# EasyEDA Pro project 国赛模拟试题文件.eprj

# Schematic 原理图文件
Create Date: 2023-05-26; Page Name: P1; Project Name: 考生demo; Schematic Name: 原理图文件; Update Date: 2023-05-26; Company: 嘉立创EDA; Page Size: A4; Version: V1.0
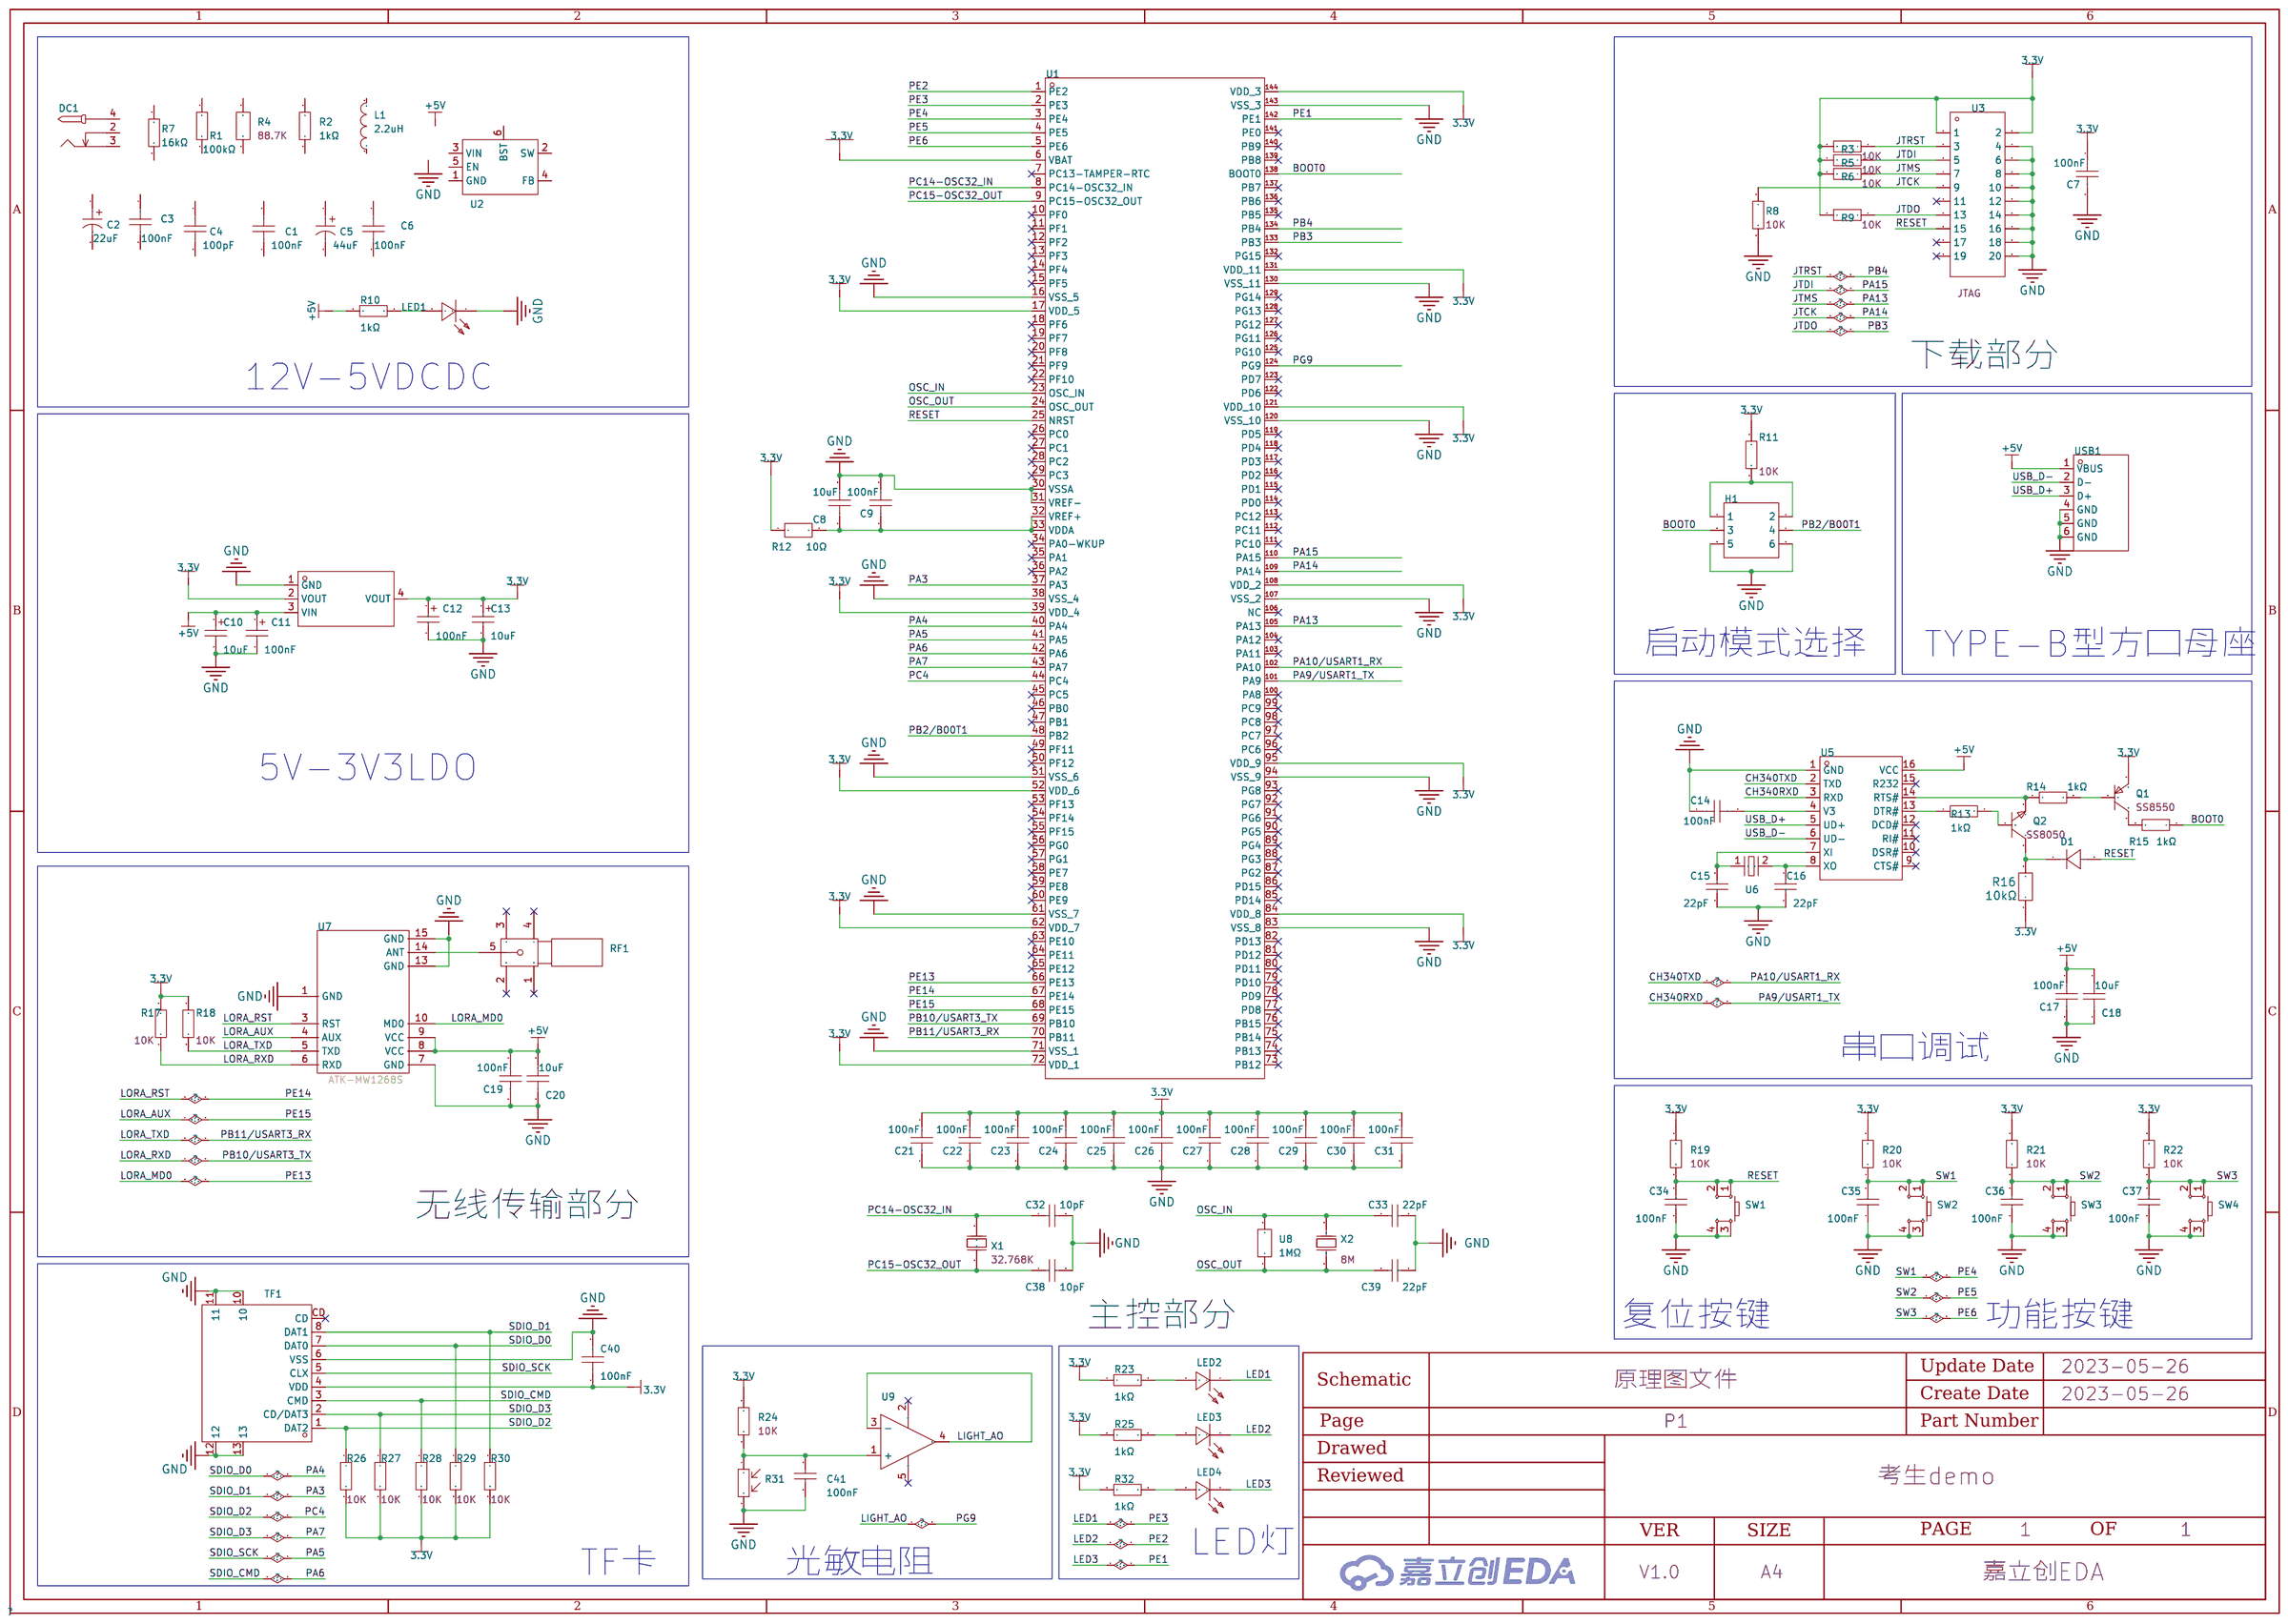
[diagram p0: schematic sheet]

## Parts
C1  100nF  [C0603]
C2  22uF  [CAP-SMD_BD5.0-L5.3-W5.3-LS5.9-FD]
C3  100nF  [C0603]
C4  100pF  [C0603]
C5  44uF  [CAP-SMD_BD5.0-L5.3-W5.3-LS5.9-FD]
C6  100nF  [C0603]
C7  100nF  [C0603]
C8  10uF  [C0603]
C9  100nF  [C0603]
C10  10uF  [CASE-D_7343]
C11  100nF  [CASE-A_3216]
C12  100nF  [CASE-A_3216]
C13  10uF  [CASE-D_7343]
C14  100nF  [C0603]
C15  22pF  [C0603]
C16  22pF  [C0603]
C17  100nF  [C0603]
C18  10uF  [C0603]
C19  100nF  [C0603]
C20  10uF  [C0603]
C21  100nF  [C0603]
C22  100nF  [C0603]
C23  100nF  [C0603]
C24  100nF  [C0603]
C25  100nF  [C0603]
C26  100nF  [C0603]
C27  100nF  [C0603]
C28  100nF  [C0603]
C29  100nF  [C0603]
C30  100nF  [C0603]
C31  100nF  [C0603]
C32  10pF  [C0603]
C33  22pF  [C0603]
C34  100nF  [C0805]
C35  100nF  [C0805]
C36  100nF  [C0805]
C37  100nF  [C0805]
C38  10pF  [C0603]
C39  22pF  [C0603]
C40  100nF  [C0603]
C41  100nF  [C0603]
D1  1N4148W  [SOD-123_L2.7-W1.6-LS3.7-RD]
DC1  -  [DC-2.0]
H1  -  [HDR-TH_6P-P2.54-V-F-R2-C3-S2.54]
L1  2.2uH  [IND-SMD_L5.2-W5.1]
LED1  HL-PT-1608S52FC-L  [LED0603-RD_RED]
LED2  HL-PT-1608S52FC-L  [LED0603-RD_RED]
LED3  HL-PT-1608S52FC-L  [LED0603-RD_RED]
LED4  HL-PT-1608S52FC-L  [LED0603-RD_RED]
Q1  SS8550  [SOT-23-3_L2.9-W1.6-P1.90-LS2.8-BR]
Q2  SS8050  [SOT-23-3_L2.9-W1.3-P1.90-LS2.4-BR]
R1  100kΩ  [R0603]
R2  1kΩ  [R0603]
R3  0603WAF1002T5E  [R0603]
R4  ERJ3EKF8452V  [R0603]
R5  0603WAF1002T5E  [R0603]
R6  0603WAF1002T5E  [R0603]
R7  16kΩ  [R0603]
R8  0603WAF1002T5E  [R0603]
R9  0603WAF1002T5E  [R0603]
R10  1kΩ  [R0603]
R11  0603WAF1002T5E  [R0603]
R12  10Ω  [R0603]
R13  1kΩ  [R0603]
R14  1kΩ  [R0603]
R15  1kΩ  [R0603]
R16  10kΩ  [R0603]
R17  0603WAF1002T5E  [R0603]
R18  0603WAF1002T5E  [R0603]
R19  0603WAF1002T5E  [R0603]
R20  0603WAF1002T5E  [R0603]
R21  0603WAF1002T5E  [R0603]
R22  0603WAF1002T5E  [R0603]
R23  1kΩ  [R0603]
R24  0603WAF1002T5E  [R0603]
R25  1kΩ  [R0603]
R26  0603WAF1002T5E  [R0603]
R27  0603WAF1002T5E  [R0603]
R28  0603WAF1002T5E  [R0603]
R29  0603WAF1002T5E  [R0603]
R30  0603WAF1002T5E  [R0603]
R31  GL5516  [RES-TH_L5.1-W4.3-P3.40-D0.5]
R32  1kΩ  [R0603]
RF1  5-1814832-2  [SMA-TH_5-1814832-2]
SW1  -  [SW-SMD_4P-L6.0-W6.0-P4.50-LS9.0-2]
SW2  -  [SW-SMD_4P-L6.0-W6.0-P4.50-LS9.0-2]
SW3  -  [SW-SMD_4P-L6.0-W6.0-P4.50-LS9.0-2]
SW4  -  [SW-SMD_4P-L6.0-W6.0-P4.50-LS9.0-2]
TF1  TF-012  [TF-SMD_TF-012]
U1  STM32F103ZET6  [LQFP-144_L20.0-W20.0-P0.50-LS22.0-BL]
U2  JW5060TTSOTB#TRPBF  [TSOT-23-6_L2.9-W1.6-P0.95-LS2.8-BR]
U3  IDC-20  [IDC-TH_20P-P2.54-V-R2-C10-S2.54]
U4  AMS1117-3.3  [SOT-223-3_L6.5-W3.4-P2.30-LS7.0-BR]
U5  CH340G  [SOIC-16_L9.9-W3.9-P1.27-LS6.0-BL]
U6  S47SMD12.000M6PF10R30B3  [HC-49S_L7.0-W4.0]
U7  -  [ATK-MW1268S]
U8  1MΩ  [R0603]
U9  LM321G-AE5-R  [SOT-23-5_L3.0-W1.7-P0.95-LS2.8-BR]
USB1  USB-B10-BRW  [USB-B-TH_USB-B10-BRW]
X1  -  [OSC-TH_BD2.0-P0.70-D0.3]
X2  -  [OSC-SMD_L5.0-W3.2]

## Library data of the parts
C1 C3 C6 C7 C9 C14 C17 C19 C21-C31 C40 = 0603B104K160NT: 容值:100nF;精度:±10%;额定电压:16V;材质(温度系数):X7R;; LCSC Part Name: 100nF±10%16V; Supplier Part: C2846678; Manufacturer: FH(风华); Supplier Footprint: 0603; JLCPCB Part Class: ExtendedPart; Datasheet: https://atta.szlcsc.com/upload/public/pdf/source/20220124/19FAC3F6718A41ED9C9A7B44850FD5EA.pdf; Supplier: LCSC; Tolerance: ±10%; Voltage Rated: 16V; Temperature Coefficient: X7R
C2 C5 = EEEFN1E470R: 容值:47uF;额定电压:25V;电容体直径:-;电容体长度:-;纹波电流:-;等效串联电阻:-;工作寿命:-;; LCSC Part Name: 47uF25V; Supplier Part: C494821; Manufacturer: PANASONIC(松下); Supplier Footprint: SMD,D5xL5.8mm; JLCPCB Part Class: ExtendedPart; Datasheet: https://atta.szlcsc.com/upload/public/pdf/source/20210722/C494821_80FC31971E2C1E665D0E685625F7861A.pdf; Supplier: LCSC; Rated Voltage: 25V
C4 = 0603N103J500: 温度系数:NP0;电容体长:-;电容体宽:-;电容体厚度:-;精度:±5%;额定电压:50V;容值:10nF;; LCSC Part Name: 10nF±5%50V; Supplier Part: C168904; Manufacturer: Walsin(华新科); Supplier Footprint: 0603; JLCPCB Part Class: ExtendedPart; Datasheet: https://atta.szlcsc.com/upload/public/pdf/source/20180122/C168904_15166127537871291467.pdf; Supplier: LCSC; Temperature Coefficient: NP0; Tolerance: ±5%; Voltage Rated: 50V
C8 C18 C20 = CL10A106KP8NNNC: 温度系数:X5R;精度:±10%;额定电压:10V;容值:10uF;; LCSC Part Name: 10uF±10%10V; Supplier Part: C19702; Manufacturer: SAMSUNG(三星); Supplier Footprint: 0603; JLCPCB Part Class: BasicPart; Datasheet: https://atta.szlcsc.com/upload/public/pdf/source/20160103/1457707703378.pdf; Supplier: LCSC; Temperature Coefficient: X5R; Tolerance: ±10%; Voltage Rated: 10V
C10 C13 = TAJD106K035RNJ: 容值:10uF;精度:±10%;额定电压:35V;等效串联电阻:1Ω@100kHz;; LCSC Part Name: 10uF±10%35V; Supplier Part: C7221; Manufacturer: KyoceraAVX; Supplier Footprint: CASE-D-7343; JLCPCB Part Class: ExtendedPart; Datasheet: https://atta.szlcsc.com/upload/public/pdf/source/20160107/1457707749365.pdf; Supplier: LCSC; Tolerance: ±10%; Rated Voltage: 35V; Equivalent Series Resistance(ESR): 1Ω@100kHz; Operating Temperature: -55℃~+125℃
C11 C12 = TAJA104K035RNJ: 容值:100nF;精度:±10%;额定电压:35V;等效串联电阻:24Ω@100kHz;; LCSC Part Name: 100nF±10%35V; Supplier Part: C7173; Manufacturer: KyoceraAVX; Supplier Footprint: CASE-A-3216; JLCPCB Part Class: ExtendedPart; Datasheet: https://atta.szlcsc.com/upload/public/pdf/source/20160107/1457707748183.pdf; Supplier: LCSC; Tolerance: ±10%; Rated Voltage: 35V; Equivalent Series Resistance(ESR): 24Ω@100kHz; Operating Temperature: -55℃~+125℃
C15 C16 C33 C39 = CL10C220JB8NNNC: 容值:22pF;精度:±5%;额定电压:50V;温度系数:C0G;; LCSC Part Name: 22pF±5%50V; Supplier Part: C1653; Manufacturer: SAMSUNG(三星); Supplier Footprint: 0603; JLCPCB Part Class: BasicPart; Datasheet: https://atta.szlcsc.com/upload/public/pdf/source/20160103/1457707687317.pdf; Supplier: LCSC; Tolerance: ±5%; Voltage Rated: 50V; Temperature Coefficient: C0G
C32 C38 = CL10C100JB8NNNC: 温度系数:C0G;精度:±5%;容值:10pF;额定电压:50V;; LCSC Part Name: 10pF±5%50V; Supplier Part: C1634; Manufacturer: SAMSUNG(三星); Supplier Footprint: 0603; JLCPCB Part Class: BasicPart; Datasheet: https://atta.szlcsc.com/upload/public/pdf/source/20160103/1457707686163.pdf; Supplier: LCSC; Temperature Coefficient: C0G; Tolerance: ±5%; Voltage Rated: 50V
C34-C37 = CL21B104KBCNNNC: 容值:100nF;精度:±10%;额定电压:50V;材质(温度系数):X7R;; LCSC Part Name: 100nF±10%50V; Supplier Part: C1711; Manufacturer: SAMSUNG(三星); Supplier Footprint: 0805; JLCPCB Part Class: ExtendedPart; Datasheet: https://atta.szlcsc.com/upload/public/pdf/source/20160103/1457707693305.pdf; Supplier: LCSC; Tolerance: ±10%; Voltage Rated: 50V; Temperature Coefficient: X7R
C41 = 0603B104K500NT: 容值:100nF;精度:±10%;额定电压:50V;材质(温度系数):X7R;; LCSC Part Name: 100nF±10%50V; Supplier Part: C30926; Manufacturer: FH(风华); Supplier Footprint: 0603; JLCPCB Part Class: ExtendedPart; Datasheet: https://atta.szlcsc.com/upload/public/pdf/source/20170923/C30926_1506149436298988724.pdf; Supplier: LCSC; Tolerance: ±10%; Voltage Rated: 50V; Temperature Coefficient: X7R
D1 = 1N4148W_C908248: 二极管配置:独立式;功率:400mW;直流反向耐压(Vr):75V;平均整流电流(Io):150mA;正向压降(Vf):1.25V@150mA;反向电流(Ir):2.5μA@75V;反向恢复时间(trr):8ns;工作温度:-55℃~+150℃@(Tj);; LCSC Part Name: 75V150mA8ns; Supplier Part: C908248; Manufacturer: FUXINSEMI(富芯森美); Supplier Footprint: SOD-123; JLCPCB Part Class: ExtendedPart; Datasheet: https://atta.szlcsc.com/upload/public/pdf/source/20201027/C908248_1CA42330540990D53F511325C125C4BD.pdf; Supplier: LCSC; Diode Configuration: 独立式; Power Dissipation: 400mW; Reverse Voltage (Vr): 75V; Average Rectified Current (Io): 150mA; Forward Voltage (Vf@If): 1.25V@150mA; Reverse Leakage Current: 2.5μA@75V; Reverse Recovery Time (trr): 8ns; Operating Temperature: -55℃~+150℃@(Tj)
DC1 = DC-005_2.0: Supplier Footprint: 插件
H1 = HDR-F_2.54_2x3: Supplier Part: C92272; Supplier Footprint: 插件
L1 = SPM5030T-4R7M: 电感值:4.7uH;精度:±20%;额定电流:3A;直流电阻(DCR):45mΩ;; LCSC Part Name: 4.7uH±20%3A45mΩ; Supplier Part: C434823; Manufacturer: TDK; Supplier Footprint: SMD; JLCPCB Part Class: ExtendedPart; Datasheet: https://atta.szlcsc.com/upload/public/pdf/source/20191009/C434823_AA3BA395349BD5C5FDBBAA471F1436E8.pdf; Supplier: LCSC; Tolerance: ±20%; Rated Current: 3A; DC Resistance (DCR): 45mΩ
LED1-LED4 = HL-PT-1608S52FC-L: 发光颜色:红灯;透镜颜色:无色透明;主波长:620nm;色温:-;测试电流:10mA;正向电压(VF):2.5V;发光强度:120mcd;功率:50mW;发光角度:130°;安装方式:正贴;工作温度:-40℃~+85℃;; LCSC Part Name: 红灯620nm光强120mcd正贴; Supplier Part: C497918; Manufacturer: HONGLITRONIC(鸿利光电); Supplier Footprint: 0603; JLCPCB Part Class: ExtendedPart; Datasheet: https://atta.szlcsc.com/upload/public/pdf/source/20200323/C497918_6BBA4137D45587D337CC6460762D4319.pdf; Supplier: LCSC; Emitted Color: 红灯; Lens Color: 无色透明; Dominant Wavelength: 620nm; Forward Current: 10mA; Forward Voltage (VF): 2.5V; Luminous Intensity: 120mcd; Power Dissipation: 50mW; Viewing Angle: 130°; Mounting Sytle: 正贴; Operating Temperature: -40℃~+85℃
Q1 = SS8550_C105430: 晶体管类型:PNP;集电极电流(Ic):1.5A;集射极击穿电压(Vceo):25V;功率(Pd):300mW;集电极-发射极饱和电压(VCE(sat)@Ic,Ib):500mV@800mA,80mA;直流电流增益(hFE@Ic,Vce):120@100mA,1V;特征频率(fT):100MHz;工作温度:+150℃@(Tj);; LCSC Part Name: SS8550L档120-200; Supplier Part: C105430; Manufacturer: CJ（江苏长电/长晶）; Supplier Footprint: SOT-23(SOT-23-3); JLCPCB Part Class: ExtendedPart; Datasheet: https://atta.szlcsc.com/upload/public/pdf/source/20191015/321CA504B3B3DA2F8CE404AA1CBAF30C.pdf; Supplier: LCSC; Transistor Type: PNP; Collector Current (Ic): 1.5A; Collector-Emitter Breakdown Voltage (Vceo): 25V; Power Dissipation (Pd): 300mW; Collector-Emitter Saturation Voltage (VCE(sat)@Ic,Ib): 500mV@800mA,80mA; DC Current Gain (hFE@Ic,Vce): 120@100mA,1V; Transition Frequency (fT): 100MHz; Operating Temperature: +150℃@(Tj)
Q2 = SS8050_C2150: 晶体管类型:NPN;集电极电流(Ic):1.5A;集射极击穿电压(Vceo):25V;功率(Pd):300mW;集电极-发射极饱和电压(VCE(sat)@Ic,Ib):500mV@800mA,80mA;直流电流增益(hFE@Ic,Vce):200@100mA,1V;特征频率(fT):100MHz;工作温度:+150℃@(Tj);; LCSC Part Name: NPNVceo=25V300mWIcbo=100nAY1200-350; Supplier Part: C2150; Manufacturer: CJ（江苏长电/长晶）; Supplier Footprint: SOT-23(SOT-23-3); JLCPCB Part Class: BasicPart; Datasheet: https://atta.szlcsc.com/upload/public/pdf/source/20140809/1457707209319.pdf; Supplier: LCSC; Transistor Type: NPN; Collector Current (Ic): 1.5A; Collector-Emitter Breakdown Voltage (Vceo): 25V; Power Dissipation (Pd): 300mW; Collector-Emitter Saturation Voltage (VCE(sat)@Ic,Ib): 500mV@800mA,80mA; DC Current Gain (hFE@Ic,Vce): 200@100mA,1V; Transition Frequency (fT): 100MHz; Operating Temperature: +150℃@(Tj)
R1 = 0603WAF1003T5E: 电阻类型:厚膜电阻;阻值:100kΩ;精度:±1%;功率:1/10W;温度系数:±100ppm/℃;最大工作电压:75V;工作温度范围:-55℃~+155℃;; LCSC Part Name: 100kΩ±1%; Supplier Part: C25803; Manufacturer: UNI-ROYAL(厚声); Supplier Footprint: 0603; JLCPCB Part Class: BasicPart; Datasheet: https://atta.szlcsc.com/upload/public/pdf/source/20200306/C422600_1E6D84923E4A46A82E41ADD87F860B5C.pdf; Supplier: LCSC; Type: 厚膜电阻; Tolerance: ±1%; Power(Watts): 1/10W; Temperature Coefficient: ±100ppm/℃; Overload Voltage (Max): 75V; Operating Temperature Range: -55℃~+155℃
R2 R10 R13-R15 R23 R25 R32 = 0603WAF1001T5E: 电阻类型:厚膜电阻;阻值:1kΩ;精度:±1%;功率:1/10W;温度系数:±100ppm/℃;最大工作电压:75V;工作温度范围:-55℃~+155℃;; LCSC Part Name: 1kΩ±1%; Supplier Part: C21190; Manufacturer: UNI-ROYAL(厚声); Supplier Footprint: 0603; JLCPCB Part Class: BasicPart; Datasheet: https://atta.szlcsc.com/upload/public/pdf/source/20200306/C422600_1E6D84923E4A46A82E41ADD87F860B5C.pdf; Supplier: LCSC; Type: 厚膜电阻; Tolerance: ±1%; Power(Watts): 1/10W; Temperature Coefficient: ±100ppm/℃; Overload Voltage (Max): 75V; Operating Temperature Range: -55℃~+155℃
R3 R5 R6 R8 R9 R11 R17-R22 R24 R26-R30 = 0603WAF1002T5E: 10K; LCSC Part Name: 10KΩ(1002)±1%编带; Supplier Part: C25804; Manufacturer: UNI-ROYAL(厚声); Supplier Footprint: 0603; JLCPCB Part Class: BasicPart; Datasheet: https://atta.szlcsc.com/upload/public/pdf/source/20170920/C25804_1505901551523983377.pdf; Supplier: LCSC
R4 = ERJ3EKF8452V: 88.7K; LCSC Part Name: 84.5KΩ(8452)±1%; Supplier Part: C403376; Manufacturer: PANASONIC(松下); Supplier Footprint: 0603; JLCPCB Part Class: ExtendedPart; Datasheet: https://atta.szlcsc.com/upload/public/pdf/source/20190709/C403376_99C9019D89337E96AE1448DBA371D6D8.pdf; Supplier: LCSC
R7 = ERJ3EKF1502V: 电阻类型:厚膜电阻;阻值:15kΩ;精度:±1%;功率:100mW;温度系数:±100ppm/℃;最大工作电压:-;工作温度范围:-55℃~+155℃;; LCSC Part Name: 15kΩ±1%100mW; Supplier Part: C192164; Manufacturer: PANASONIC(松下); Supplier Footprint: 0603; JLCPCB Part Class: ExtendedPart; Datasheet: https://atta.szlcsc.com/upload/public/pdf/source/20180502/C192164_A3A5EBA85BD799368C6F6D8A465C89BE.pdf; Supplier: LCSC; Type: 厚膜电阻; Tolerance: ±1%; Power(Watts): 100mW; Temperature Coefficient: ±100ppm/℃; Operating Temperature Range: -55℃~+155℃
R12 = ERJUP3D10R0V: 阻值:10Ω;精度:±0.5%;功率:250mW;; LCSC Part Name: 10Ω±0.5%250mW; Supplier Part: C491216; Manufacturer: PANASONIC(松下); Supplier Footprint: 0603; JLCPCB Part Class: ExtendedPart; Datasheet: https://atta.szlcsc.com/upload/public/pdf/source/20200407/C491216_2E39EC09AE614A2EE2B1246D53854D38.pdf; Supplier: LCSC; Tolerance: ±0.5%; Power(Watts): 250mW
R16 = 10kΩ: 3DModel: R0603_L1.6-W0.8-H0.8; link: https://www.mouser.in/datasheet/2/447/PYu_RT_1_to_0_01_RoHS_L_11-1669912.pdf; Supplier: LCSC; Supplier Part: C880254; Manufacturer: KOASpeerElec; Manufacturer Part: SG73P1JTTD1002F; JLCPCB Part Class: ExtendedPart
R31 = GL5516: 光谱峰值(波长):540nm;最大电压:150V;亮电阻@10Lux:5kΩ~10kΩ;暗电阻:500kΩ;; Supplier Part: C125626; Manufacturer: 森霸; Supplier Footprint: 直插; JLCPCB Part Class: ExtendedPart; Datasheet: https://atta.szlcsc.com/upload/public/pdf/source/20170810/C125626_1502335364025879942.pdf; Supplier: LCSC; Spectral Peak: 540nm; Applied Voltage: 150V; Illuminated Resistance @ 10Lux: 5kΩ~10kΩ; Dark Resistance: 500kΩ
RF1 = 5-1814832-2: 连接器类型:板端;射频系列:SMA;接口类型:内孔;端口数量:1;阻抗:50Ω;频率-最大值:6GHz;样式:正脚;接口直径:6.35mm;接口长度/高度:-;工作温度范围:-65℃~+165℃;; LCSC Part Name: 5-1814832-2（替代停产型号5-1814832-1）; Supplier Part: C482015; Manufacturer: TEConnectivity(美国泰科); Supplier Footprint: 插件; JLCPCB Part Class: ExtendedPart; Datasheet: https://atta.szlcsc.com/upload/public/pdf/source/20200325/C482015_F24B1F143DB8F5604C8B10AC213D9A0B.pdf; Supplier: LCSC; Connector Type: 板端; RF Series: SMA; Interface Type: 内孔; Number of Ports: 1; Impedance: 50Ω; Frequency-Max: 6GHz; Sytle: 正脚; Interface Diameter: 6.35mm; Operating Temperature Range: -65℃~+165℃
SW1-SW4 = Key_SMD_6x6x6.5: Supplier Footprint: SMD
TF1 = TF-012: 卡连接方式:自弹式;卡类型:MicroSD卡(TF卡);连接器类型:卡座;本体最大高度:2mm;触头镀层:镀金;工作温度范围:-25℃~+85℃;; LCSC Part Name: 自弹式MicroSD卡(TF卡)卡座; Supplier Part: C410350; Manufacturer: HANBO(汉博); Supplier Footprint: SMD; JLCPCB Part Class: ExtendedPart; Datasheet: https://atta.szlcsc.com/upload/public/pdf/source/20221111/BB81CC7778DE10777740A0A95254EE6F.pdf; Supplier: LCSC; Card Connection Mode: 自弹式; Card Type: MicroSD卡(TF卡); Connector Type: 卡座; Maximum Body Height: 2mm; Contact Plating: 镀金; Operating Temperature Range: -25℃~+85℃
U1 = STM32F103ZET6: 工作电压:2V~3.6V;主频（MAX):72MHz;; Supplier Part: C8287; Manufacturer: ST(意法半导体); Supplier Footprint: LQFP-144_20x20x05P; JLCPCB Part Class: BasicPart; Datasheet: https://atta.szlcsc.com/upload/public/pdf/source/20140724/1457707169030.pdf; Supplier: LCSC; UART/USART: 3USART+2UART; SPI: 3; USB Device: 1; PWM: 18; LCD: LCDparallelinterface,8080/6800modes; I2C（SMBUS/PMBUS）: 2; Voltage - Supply (Vcc/Vdd): 2V~3.6V; CAN: 1; A/D: 21x12bit; D/A: 2x12bit; Program Memory Size: 512KB; RAM Size: 64KB; Speed: 72MHz; Number of I/O: 112
U2 = JW5060TTSOTB#TRPBF: 可输出电流:-;最大输入电压:-;; Supplier Part: C371420; Manufacturer: Joulwatt(杰华特); Supplier Footprint: TSOT23-6; JLCPCB Part Class: ExtendedPart; Datasheet: https://atta.szlcsc.com/upload/public/pdf/source/20190301/C371420_92ADC5F8B21D6F45801DC43D0205CFF3.pdf; Supplier: LCSC
U3 = IDC-20: Supplier Part: C9900015890; Supplier Footprint: JTAG; JLCPCB Part Class: ExtendedPart; Datasheet: https://atta.szlcsc.comnull; Supplier: LCSC
U4 = AMS1117-3.3_C6186: 输出类型:固定;输出极性:正;最大输入电压:-;输出电压:3.3V;输出电流:1A;电源纹波抑制比(PSRR):72dB@(120Hz);; LCSC Part Name: 正Vout=3.3V1A72dB@(120Hz); Supplier Part: C6186; Manufacturer: AMS; Supplier Footprint: SOT-223; JLCPCB Part Class: BasicPart; Datasheet: https://atta.szlcsc.com/upload/public/pdf/source/20180727/C6186_7A095716F0823C02F1997A905E26C086.pdf; Supplier: LCSC; Output Type: 固定; Output Polarity: 正; Number of Outputs: 1; Output Voltage: 3.3V; Dropout Voltage: 1.3V@(800mA); Output Current: 1A; Power Supply Rejection Ratio (PSRR): 72dB@(120Hz)
U5 = CH340G: 驱动器/接收器数:-;协议类别:USB2.0;类型:Transceiver;数据速率:2Mbps;; Supplier Part: C14267; Manufacturer: WCH(南京沁恒); Supplier Footprint: SOP-16_150mil; JLCPCB Part Class: BasicPart; Datasheet: https://atta.szlcsc.com/upload/public/pdf/source/20200819/C14267_9F0B4B8160AEBA86F3219E64956E4601.pdf; Supplier: LCSC; Protocol: USB2.0; Type: Transceiver; Supply Voltage: 3.3V,5V; Data Rate: 2Mbps
U6 = S47SMD12.000M6PF10R30B3: LCSC Part Name: 12M6PF10PPM; Supplier Part: C5346046; Manufacturer: SST(索斯特); Supplier Footprint: HC-49S-SMD-2P-Mini; JLCPCB Part Class: ExtendedPart; Datasheet: https://atta.szlcsc.com/upload/public/pdf/source/20230109/270D3F1BF73EF96A3273D6DAB9828B2A.pdf; Supplier: LCSC
U7 = ATK-MW1268S: 正点原子无线串口loRa模块ATK-MW1268S
U8 = TC0325B1004T5F: 阻值:1MΩ;精度:±0.1%;功率:100mW;温度系数:-;; LCSC Part Name: 1MΩ±0.1%100mW; Supplier Part: C2989464; Manufacturer: UNI-ROYAL(厚声); Supplier Footprint: 0603; JLCPCB Part Class: ExtendedPart; Datasheet: https://atta.szlcsc.com/upload/public/pdf/source/20220708/6ACD1707201702E70C0F417A19EB926E.pdf; Supplier: LCSC; Tolerance: ±0.1%; Power(Watts): 100mW
U9 = LM321G-AE5-R: 放大器组数:1;; Supplier Part: C100068; Manufacturer: UTC(友顺); Supplier Footprint: SOT-23-5; JLCPCB Part Class: ExtendedPart; Datasheet: https://atta.szlcsc.com/upload/public/pdf/source/20170412/1491969074515.pdf; Supplier: LCSC; Number of Circuits: 1
USB1 = USB-B10-BRW: 连接器类型:Type-B;标准:USB2.0;公母:母座;触点数量:4.0;端口数量:1;安装方式:弯插;额定电流-电源:1.5A;工作温度范围:-20℃~+70℃;焊接温度(最大值):260℃;; Supplier Part: C720549; Manufacturer: XUNPU(讯普); Supplier Footprint: 插件; JLCPCB Part Class: ExtendedPart; Datasheet: https://atta.szlcsc.com/upload/public/pdf/source/20200812/C720549_53E9294752E2933874870440E626C579.pdf; Supplier: LCSC; Connector Type: Type-B; Standard: USB2.0; Gender: 母座; Number of Contacts: 4.0; Number of Ports: 1; Mounting Sytle: 弯插; Current Rating - Power (Max): 1.5A; Operating Temperature Range: -20℃~+70℃; Welding Temperature (Max): 260℃
X1 = CFS20632768DZF: 晶振类型:-;频率:-;负载电容:-;工作温度:-;; LCSC Part Name: 32.768KHZ12.5PF; Supplier Part: C389950; Manufacturer: CITIZEN; Supplier Footprint: DT-26; JLCPCB Part Class: ExtendedPart; Datasheet: https://atta.szlcsc.com/upload/public/pdf/source/20190523/C389950_CF194012EBE457CC05EFA6AF3711F50C.pdf; Supplier: LCSC; Operating Temperature: 32.768K
X2 = TAXM8M2QLFCDT1T: 频率:-;晶振类型:-;负载电容:-;频率公差:-;频率稳定度:-;工作温度:-;; LCSC Part Name: 8MHz ±30ppm 20pF; Supplier Part: C122522; Manufacturer: TAE(雅晶鑫); Supplier Footprint: SMD5032-2P; JLCPCB Part Class: ExtendedPart; Datasheet: https://atta.szlcsc.com/upload/public/pdf/source/20170724/1500893306427.pdf; Supplier: LCSC; Operating Temperature: 8M

## Nets
3.3V: C7.1 C12.1 C13.1 C21.1 C22.1 C23.1 C24.1 C25.1 C26.1 C27.1 C28.1 C29.1 C30.1 C31.1 C40.1 Q1.2 R3.2 R5.2 R6.2 R9.2 R11.1 R12.1 R16.1 R17.2 R18.2 R19.2 R20.2 R21.2 R22.2 R23.1 R24.1 R25.1 R26.2 R27.2 R28.2 R29.2 R30.2 R32.1 TF1.4(VDD) U1.6(VBAT) U1.17(VDD_5) U1.39(VDD_4) U1.52(VDD_6) U1.62(VDD_7) U1.72(VDD_1) U1.84(VDD_8) U1.95(VDD_9) U1.108(VDD_2) U1.121(VDD_10) U1.131(VDD_11) U1.144(VDD_3) U3.1 U3.2 U4.2(VOUT) U4.4(VOUT)
+5V: C10.1 C11.1 C17.1 C18.2 C19.1 C20.2 R10.1 U4.3(VIN) U5.16(VCC) U7.8(VCC) U7.9(VCC) USB1.1(VBUS)
GND: C7.2 C8.2 C9.1 C10.2 C11.2 C12.2 C13.2 C14.1 C15.2 C16.2 C17.2 C18.1 C19.2 C20.1 C21.2 C22.2 C23.2 C24.2 C25.2 C26.2 C27.2 C28.2 C29.2 C30.2 C31.2 C32.2 C33.1 C34.1 C35.1 C36.1 C37.1 C38.2 C39.1 C40.2 C41.1 H1.5 H1.6 LED1.1(K) R8.2 R31.2 SW1.3 SW1.4 SW2.3 SW2.4 SW3.3 SW3.4 SW4.3 SW4.4 TF1.6(VSS) TF1.10 TF1.11 TF1.12 TF1.13 U1.16(VSS_5) U1.30(VSSA) U1.31(VREF-) U1.38(VSS_4) U1.51(VSS_6) U1.61(VSS_7) U1.71(VSS_1) U1.83(VSS_8) U1.94(VSS_9) U1.107(VSS_2) U1.120(VSS_10) U1.130(VSS_11) U1.143(VSS_3) U3.4 U3.6 U3.8 U3.10 U3.12 U3.14 U3.16 U3.18 U3.20 U4.1(GND) U5.1(GND) U7.1(GND) U7.7(GND) U7.13(GND) U7.15(GND) USB1.4(GND) USB1.5(GND) USB1.6(GND)
BOOT0: H1.3 R15.1 U1.138(BOOT0)
CH340RXD: U1.101(PA9) U5.3(RXD)
CH340TXD: U1.102(PA10) U5.2(TXD)
JTCK: R8.1 U1.109(PA14) U3.9
JTDI: R5.1 U1.110(PA15) U3.5
JTDO: R9.1 U1.133(PB3) U3.13
JTMS: R6.1 U1.105(PA13) U3.7
JTRST: R3.1 U1.134(PB4) U3.3
LED1: LED2.1(K) U1.2(PE3)
LED2: LED3.1(K) U1.1(PE2)
LED3: LED4.1(K) U1.142(PE1)
LIGHT_AO: U1.124(PG9) U9.3(-) U9.4(OUT)
LORA_AUX: U1.68(PE15) U7.4(AUX)
LORA_MD0: U1.66(PE13) U7.10(MD0)
LORA_RST: U1.67(PE14) U7.3(RST)
LORA_RXD: R17.1 U1.69(PB10) U7.6(RXD)
LORA_TXD: R18.1 U1.70(PB11) U7.5(TXD)
OSC_IN: C33.2 U1.23(OSC_IN) U8.2 X2.2(OSC2)
OSC_OUT: C39.2 U1.24(OSC_OUT) U8.1 X2.1(OSC1)
PA3: R30.1 TF1.8(DAT1) U1.37(PA3)
PA4: R29.1 TF1.7(DAT0) U1.40(PA4)
PA5: TF1.5(CLX) U1.41(PA5)
PA6: R28.1 TF1.3(CMD) U1.42(PA6)
PA7: R27.1 TF1.2(CD/DAT3) U1.43(PA7)
PB2/B00T1: H1.4 U1.48(PB2)
PC4: R26.1 TF1.1(DAT2) U1.44(PC4)
PC14-OSC32_IN: C32.1 U1.8(PC14-OSC32_IN) X1.1(OSC1)
PC15-OSC32_OUT: C38.1 U1.9(PC15-OSC32_OUT) X1.2(OSC2)
PE4: C35.2 R20.1 SW2.1 SW2.2 U1.3(PE4)
PE5: C36.2 R21.1 SW3.1 SW3.2 U1.4(PE5)
PE6: C37.2 R22.1 SW4.1 SW4.2 U1.5(PE6)
RESET: C34.2 D1.2(A) R19.1 SW1.1 SW1.2 U1.25(NRST) U3.15
USB_D+: U5.5(UD+) USB1.3(D+)
USB_D-: U5.6(UD-) USB1.2(D-)
Net-(C8-1): C8.1 C9.2 R12.2 U1.32(VREF+) U1.33(VDDA)
Net-(C14-2): C14.2 U5.4(V3)
Net-(C15-1): C15.1 U5.7(XI) U6.1
Net-(C16-1): C16.1 U5.8(XO) U6.2(GND)
Net-(C41-2): C41.2 R24.2 R31.1 U9.1(+)
Net-(D1-1): D1.1(K) Q2.3(C) R16.2
Net-(H1-1): H1.1 H1.2 R11.2
Net-(LED1-2): LED1.2(A) R10.2
Net-(LED2-2): LED2.2(A) R23.2
Net-(LED3-2): LED3.2(A) R25.2
Net-(LED4-2): LED4.2(A) R32.2
Net-(Q1-1): Q1.1 R14.2
Net-(Q1-3): Q1.3 R15.2
Net-(Q2-1): Q2.1(B) R13.2
Net-(Q2-2): Q2.2(E) R14.1 U5.14(RTS#)
Net-(R13-1): R13.1 U5.13(DTR#)
Net-(RF1-5): RF1.5 U7.14(ANT)

Not connected (* = marked no-connect by the designer): C1 1 2; C2 1 2; C3 1 2; C4 1 2; C5 1 2; C6 1 2; DC1 2 3 4; L1 1 2; R1 1 2; R2 1 2; R4 1 2; R7 1 2; RF1 1* 2* 3* 4*; TF1 CD*; U1 7(PC13-TAMPER-RTC)* 10(PF0)* 11(PF1)* 12(PF2)* 13(PF3)* 14(PF4)* 15(PF5)* 18(PF6)* 19(PF7)* 20(PF8)* 21(PF9)* 22(PF10)* 26(PC0)* 27(PC1)* 28(PC2)* 29(PC3)* 34(PA0-WKUP)* 35(PA1)* 36(PA2)* 45(PC5)* 46(PB0)* 47(PB1)* 49(PF11)* 50(PF12)* 53(PF13)* 54(PF14)* 55(PF15)* 56(PG0)* 57(PG1)* 58(PE7)* 59(PE8)* 60(PE9)* 63(PE10)* 64(PE11)* 65(PE12)* 73(PB12)* 74(PB13)* 75(PB14)* 76(PB15)* 77(PD8)* 78(PD9)* 79(PD10)* 80(PD11)* 81(PD12)* 82(PD13)* 85(PD14)* 86(PD15)* 87(PG2)* 88(PG3)* 89(PG4)* 90(PG5)* 91(PG6)* 92(PG7)* 93(PG8)* 96(PC6)* 97(PC7)* 98(PC8)* 99(PC9)* 100(PA8)* 103(PA11)* 104(PA12)* 106(NC)* 111(PC10)* 112(PC11)* 113(PC12)* 114(PD0)* 115(PD1)* 116(PD2)* 117(PD3)* 118(PD4)* 119(PD5)* 122(PD6)* 123(PD7)* 125(PG10)* 126(PG11)* 127(PG12)* 128(PG13)* 129(PG14)* 132(PG15)* 135(PB5)* 136(PB6)* 137(PB7)* 139(PB8)* 140(PB9)* 141(PE0)*; U2 1(GND) 2(SW) 3(VIN) 4(FB) 5(EN) 6(BST); U3 11* 17* 19*; U5 9(CTS#)* 10(DSR#)* 11(RI#)* 12(DCD#)* 15(R232)*; U9 2(GND)* 5(VCC+)*

## Notes on the sheet
- 下载部分
- 12V-5VDCDC
- 启动模式选择
- TYPE-B型方口母座
- 5V-3V3LDO
- 串口调试
- 无线传输部分
- 主控部分
- 复位按键
- 功能按键
- LED灯
- TF卡
- 光敏电阻

# Board PCB文件
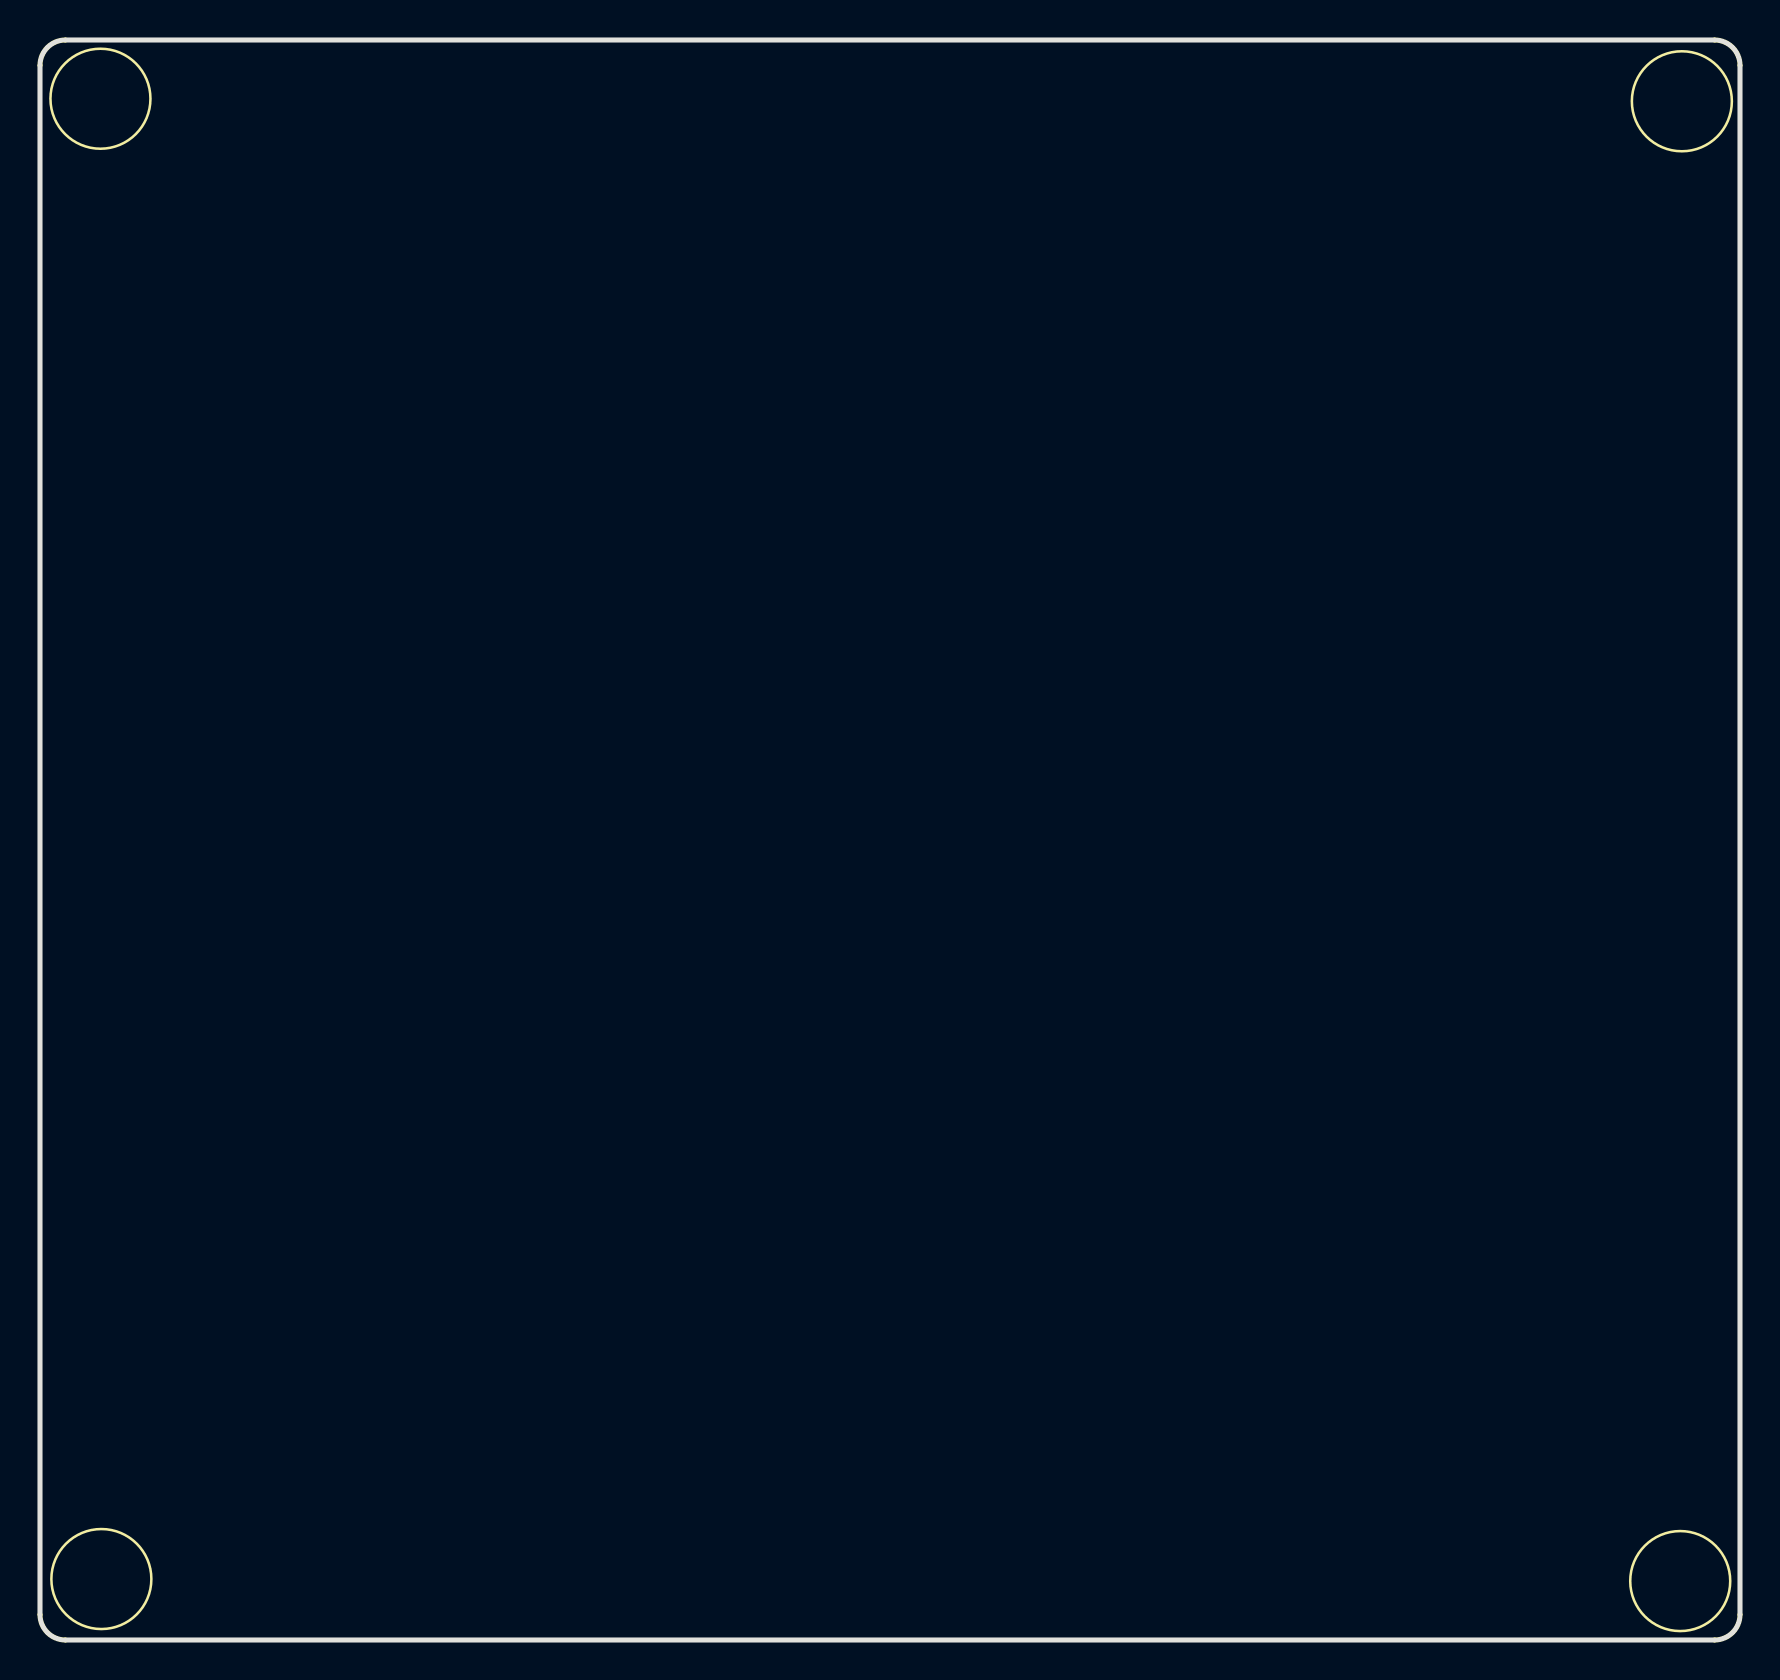
[diagram p1: board, top side]
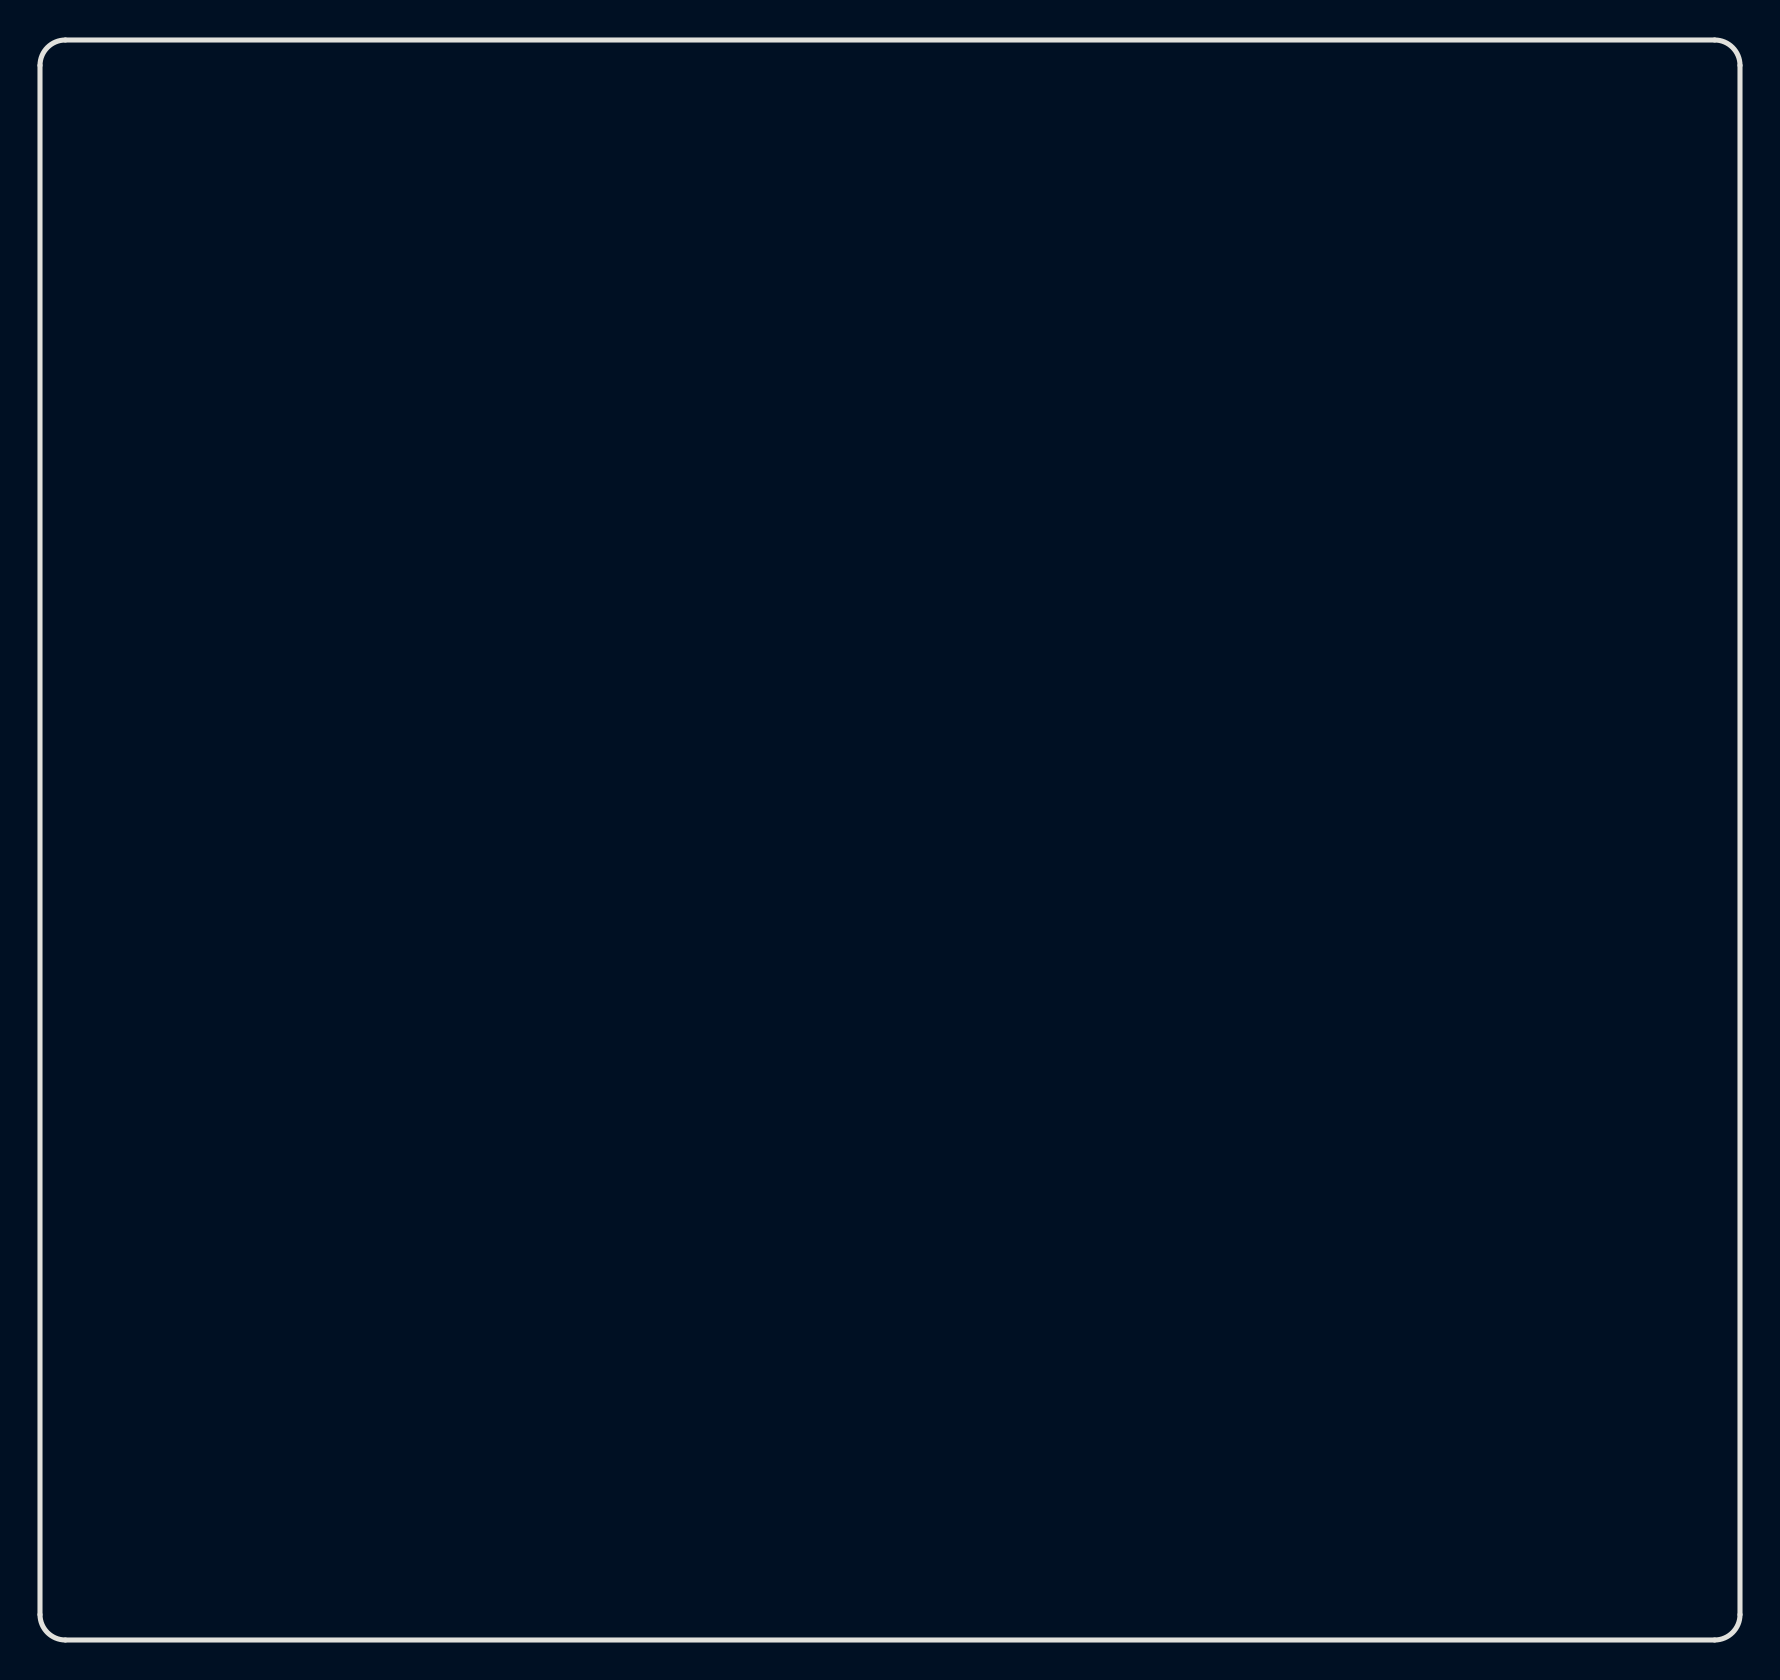
[diagram p2: board, bottom side, seen from below]

Outline 85 x 80 mm; copper layers: Top Layer, Bottom Layer. Coordinates in mm from the lower left corner of the outline.
Outline path: 0,78.73 0,1.27 arc(0.37,0.37) 1.27,0 83.73,0 arc(84.63,0.37) 85,1.27 85,78.73 arc(84.63,79.63) 83.73,80 1.27,80 arc(0.37,79.63) 0,78.73
Stack: Top Layer 0.035mm / Dielectric1 1.51mm FR4 er 4.5 / Bottom Layer 0.035mm

## Design rules (mm)
template: JLCPCB Capability(Two Layers Board)
spacing copperThickness1oz (default): track to track 0.102, other pairs 0.152 to 0.3
spacing copperThickness2oz: track to track 0.203, other pairs 0.152 to 0.3
track width copperThickness1oz (default): min 0.127, default 0.254, max 2.54
track width copperThickness2oz: min 0.203, default 0.254, max 2.54
differential pair differentialPair (default): width min 0.127, default 0.254, max 2.54; gap min 0.152, default 0.152
via viaSize (default): diameter min 0.5, default 0.61, max 10; hole min 0.3, default 0.305, max 6.3

## Placement (name value [footprint] x y rotation side)

## Nets
As in the schematic.
